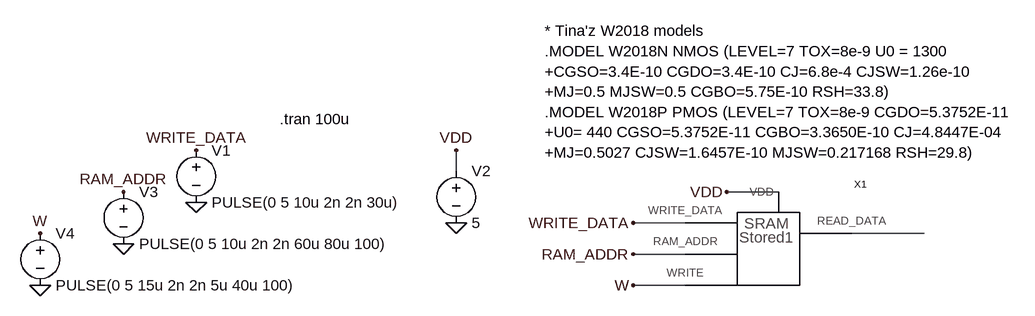
[diagram p0: schematic SRAM_cellsramtzTESTsymbol.asc]
SRAM_cellsramtzTESTsymbol.asc, the LTspice schematic file:
Version 4
SHEET 1 880 680
WIRE -144 64 -144 32
WIRE 352 96 272 96
WIRE 208 144 128 144
WIRE 576 160 464 160
WIRE 208 192 128 192
WIRE 208 240 128 240
FLAG -656 176 0
FLAG -544 112 0
FLAG -144 144 0
FLAG -144 32 VDD
FLAG -544 32 WRITE_DATA
FLAG -656 96 RAM_ADDR
FLAG -784 240 0
FLAG -784 160 W
FLAG 272 96 VDD
FLAG 128 144 WRITE_DATA
FLAG 128 192 RAM_ADDR
FLAG 128 240 W
SYMBOL voltage -544 16 R0
WINDOW 123 0 0 Left 2
WINDOW 39 0 0 Left 2
SYMATTR InstName V1
SYMATTR Value PULSE(0 5 10u 2n 2n 30u)
SYMBOL voltage -144 48 R0
SYMATTR InstName V2
SYMATTR Value 5
SYMBOL voltage -656 80 R0
WINDOW 123 0 0 Left 2
WINDOW 39 0 0 Left 2
SYMATTR InstName V3
SYMATTR Value PULSE(0 5 10u 2n 2n 60u 80u 100)
SYMBOL voltage -784 144 R0
WINDOW 123 0 0 Left 2
WINDOW 39 0 0 Left 2
SYMATTR InstName V4
SYMATTR Value PULSE(0 5 15u 2n 2n 5u 40u 100)
SYMBOL SRAM_cellsramtz1 320 176 R0
SYMATTR InstName X1
TEXT -416 -16 Left 2 !.tran 100u
TEXT -8 -152 Left 2 !* Tina'z W2018 models\n.MODEL W2018N NMOS (LEVEL=7 TOX=8e-9 U0 = 1300\n+CGSO=3.4E-10 CGDO=3.4E-10 CJ=6.8e-4 CJSW=1.26e-10\n+MJ=0.5 MJSW=0.5 CGBO=5.75E-10 RSH=33.8)\n.MODEL W2018P PMOS (LEVEL=7 TOX=8e-9 CGDO=5.3752E-11\n+U0= 440 CGSO=5.3752E-11 CGBO=3.3650E-10 CJ=4.8447E-04\n+MJ=0.5027 CJSW=1.6457E-10 MJSW=0.217168 RSH=29.8)

The netlist it stands for:
* SRAM_cellsramtzTESTsymbol.asc
V1 WRITE_DATA 0 PULSE(0 5 10u 2n 2n 30u)
V2 VDD 0 5
V3 RAM_ADDR 0 PULSE(0 5 10u 2n 2n 60u 80u 100)
V4 W 0 PULSE(0 5 15u 2n 2n 5u 40u 100)
XX1 VDD N001 WRITE_DATA RAM_ADDR W SRAM_cellsramtz1  ; pins VDD READ_DATA WRITE_DATA RAM_ADDR WRITE
.tran 100u
* Tina'z W2018 models
.MODEL W2018N NMOS (LEVEL=7 TOX=8e-9 U0 = 1300
+CGSO=3.4E-10 CGDO=3.4E-10 CJ=6.8e-4 CJSW=1.26e-10
+MJ=0.5 MJSW=0.5 CGBO=5.75E-10 RSH=33.8)
.MODEL W2018P PMOS (LEVEL=7 TOX=8e-9 CGDO=5.3752E-11
+U0= 440 CGSO=5.3752E-11 CGBO=3.3650E-10 CJ=4.8447E-04
+MJ=0.5027 CJSW=1.6457E-10 MJSW=0.217168 RSH=29.8)
.backanno
.end